# Altium schematic sheet EEPROM.SchDoc
size A4
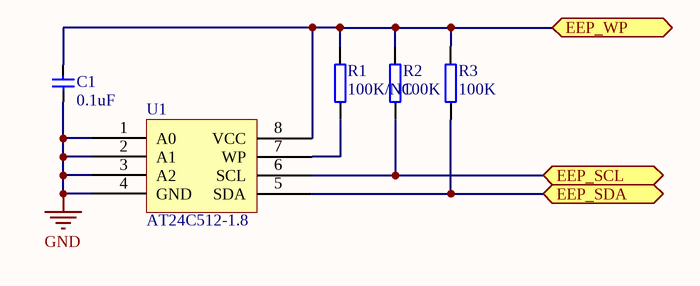
[diagram p0: EEPROM.SchDoc]

## Parts
C1  0.1uF  [0603C]
R1  100K/NC  [0603R]
R2  100K  [0603R]
R3  100K  [0603R]
U1  AT24C512-1.8  [SOP8]

## Ports
EEP_SCL, EEP_SDA, EEP_WP

## Nets
GND: C1.1 U1.1(A0) U1.2(A1) U1.3(A2) U1.4(GND)
EEP_SCL: R2.2 U1.6(SCL) ; port EEP_SCL
EEP_SDA: R3.2 U1.5(SDA) ; port EEP_SDA
EEP_WP: C1.2 R1.2 R2.1 R3.1 U1.8(VCC) ; port EEP_WP
NetR1_1: R1.1 U1.7(WP)

## Library data of the parts
C1 = CAP
R1-R3 = RES2A